# Altium schematic sheet BlueTooth.SchDoc
size A
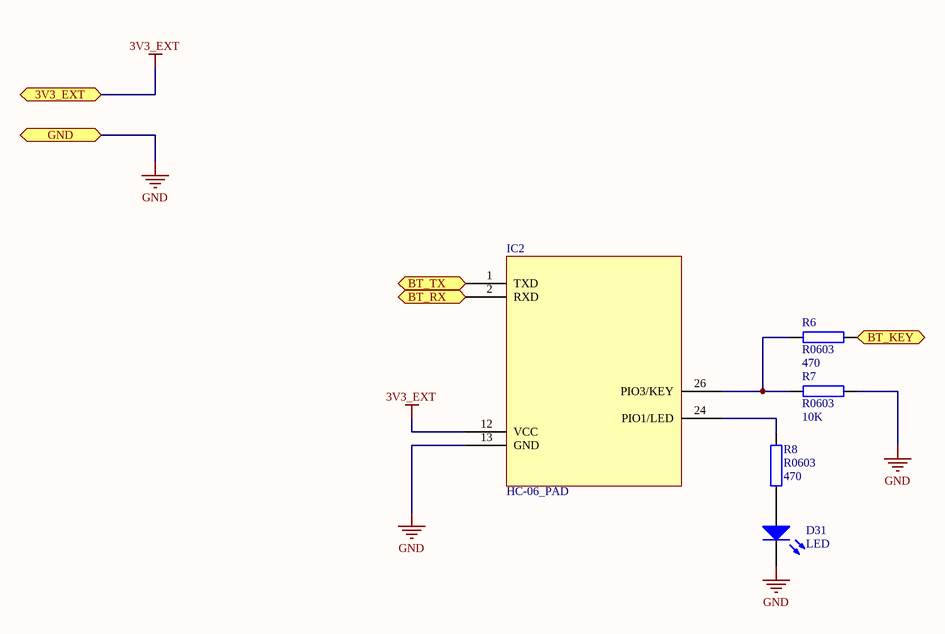
[diagram p0: BlueTooth.SchDoc]

## Parts
D31  LED  [LED_0603]
IC2  HC-06_PAD  [HC-0X_PAD]
R6  R0603  value 470  [R0603]
R7  R0603  value 10K  [R0603]
R8  R0603  value 470  [R0603]

## Ports
3V3_EXT, BT_KEY (in), BT_RX (in), BT_TX (out), GND

## Nets
3V3_EXT: IC2.12(VCC) ; port 3V3_EXT
GND: D31.2(K) IC2.13(GND) R7.2 ; port GND
BT_KEY: R6.2 ; port BT_KEY
BT_RX: IC2.2(RXD) ; port BT_RX
BT_TX: IC2.1(TXD) ; port BT_TX
NetD31_1: D31.1(A) R8.1
NetIC2_24: IC2.24(PIO1/LED) R8.2
NetIC2_26: IC2.26(PIO3/KEY) R6.1 R7.1

## Library data of the parts
D31 = LED: Typical INFRARED GaAs LED; Published: 8-Jun-2000; LatestRevisionDate: 08-Jul-2005; LatestRevisionNote: Mech Layer 1 removed.; PackageReference: LED-0; Publisher: Altium Limited; PackageDescription: LED; 2 Leads
R6-R8 = Res3: Resistor; Published: 8-Jun-2000; LatestRevisionDate: 29-May-2009; LatestRevisionNote: IPC-7351 Footprint Added.; PackageReference: R0603; Publisher: Altium Limited; PackageDescription: Chip Resistor